# Altium schematic sheet fMuxBoardOverview.SchDoc: Overview of fMux MotherBoard
size C; Author: Matt.Dobbs@McGill.ca; Revision: 3, Oct 2007; PageSetup: Record=PageOptions|CenterHorizontal=True|CenterVertical=True|PrintScale=0.54|XCorrection=1.00|YCorrection=1.00|PrintKind=2|BorderSize=5000000|LeftOffset=0|BottomOffset=0|Orientation=2|PaperLength=1000|PaperWidth=1000|Scale=100|PaperSource=15|PrintQuality=1200|MediaType=1|DitherType=10|PaperKind=Letter|PrintScaleMode=1
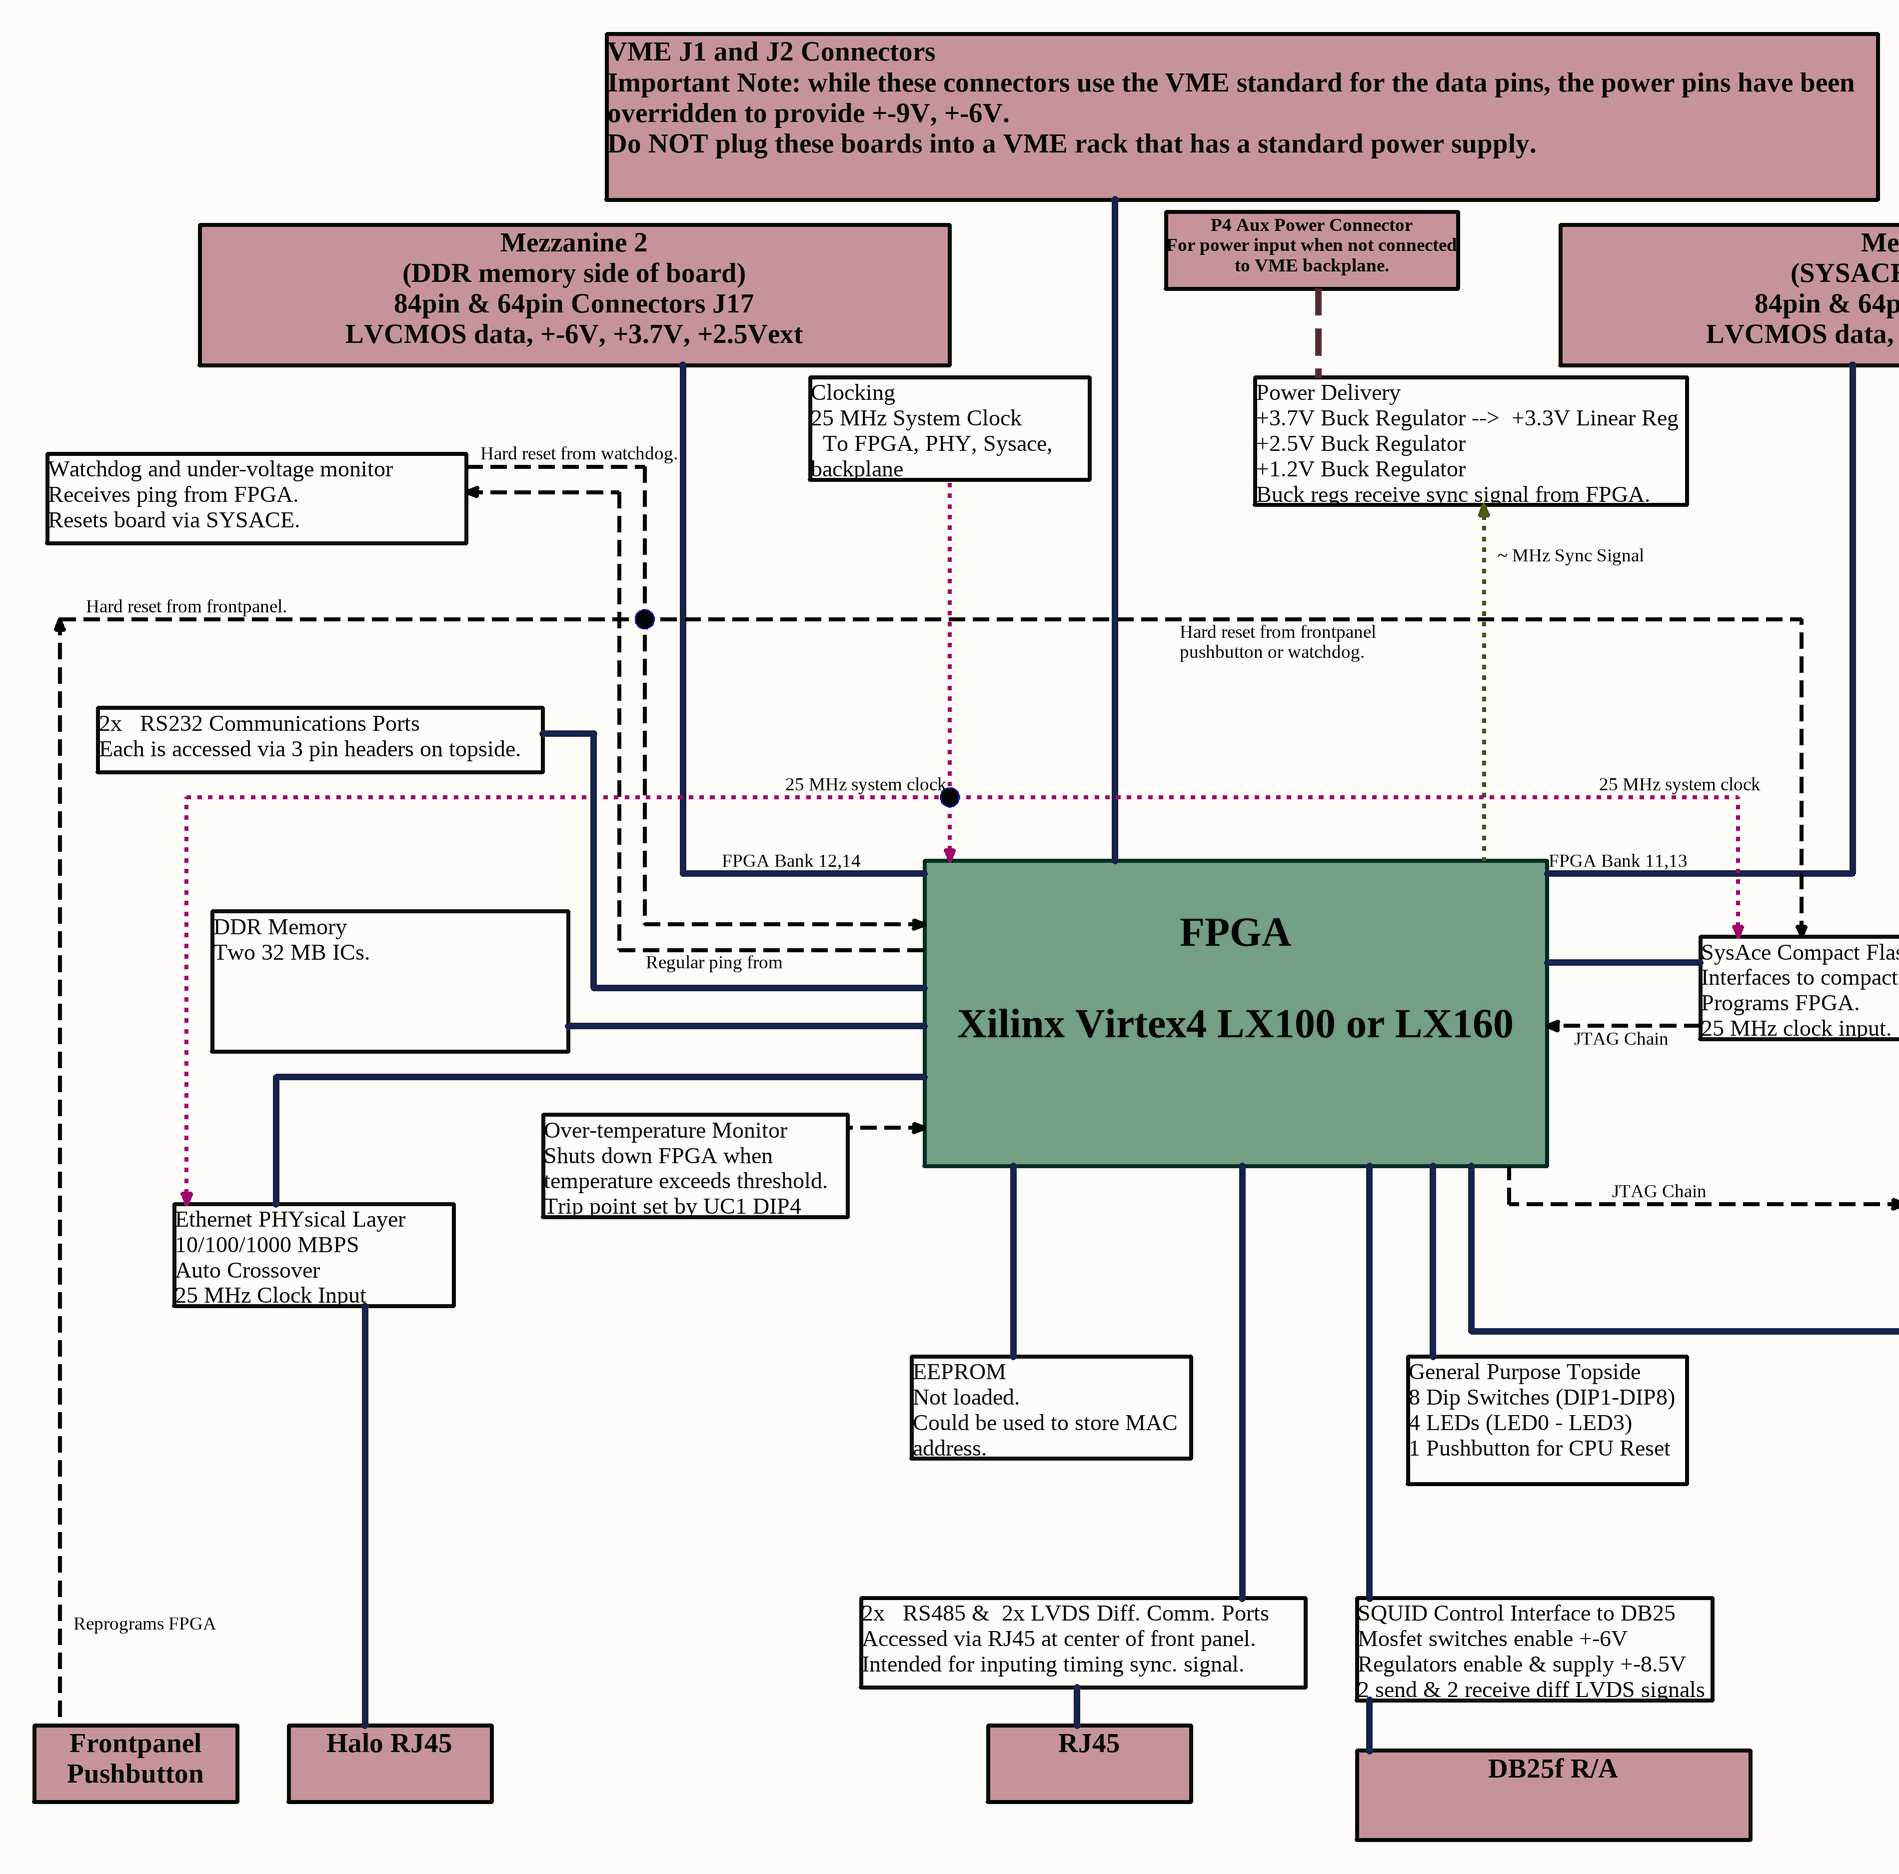
[diagram p0: fMuxBoardOverview.SchDoc, left]
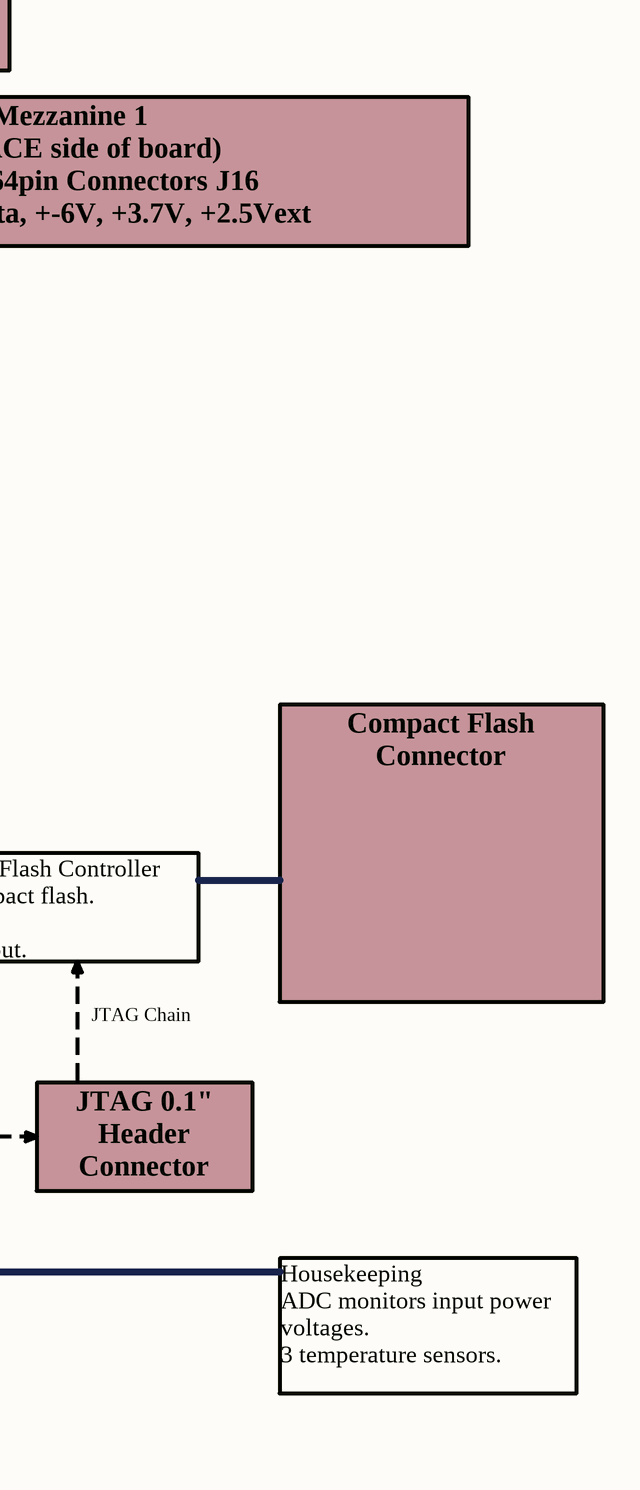
[diagram p1: fMuxBoardOverview.SchDoc, right]

## Notes on the sheet
- VME J1 and J2 Connectors
  Important Note: while these connectors use the VME standard for the data pins, the power pins have been overridden to provide +-9V, +-6V.
  Do NOT plug these boards into a VME rack that has a standard power supply.
- P4 Aux Power Connector
  For power input when not connected to VME backplane.
- Mezzanine 2
  (DDR memory side of board)
  84pin & 64pin Connectors J17
  LVCMOS data, +-6V, +3.7V, +2.5Vext
- Mezzanine 1
  (SYSACE side of board)
  84pin & 64pin Connectors J16
  LVCMOS data, +-6V, +3.7V, +2.5Vext
- Hard reset from watchdog.
- Clocking
  25 MHz System Clock
  To FPGA, PHY, Sysace, backplane
  Sourced from half size (DIP8) socket or backplane.
  To/from backplane as LVCMOS and/or LVDS.
  User Clock to FPGA (not normally used)
- Power Delivery
  +3.7V Buck Regulator -->  +3.3V Linear Reg
  +2.5V Buck Regulator
  +1.2V Buck Regulator
  Buck regs receive sync signal from FPGA.
- Watchdog and under-voltage monitor
  Receives ping from FPGA.
  Resets board via SYSACE.
- ~ MHz Sync Signal
- Hard reset from frontpanel.
- Hard reset from frontpanel pushbutton or watchdog.
- 2x   RS232 Communications Ports
  Each is accessed via 3 pin headers on topside.
- 25 MHz system clock
- FPGA Bank 12,14
- FPGA Bank 11,13
- Regular ping from FPGA (~1 Hz)
- DDR Memory
  Two 32 MB ICs.
- JTAG Chain
- SysAce Compact Flash Controller
  Interfaces to compact flash.
  Programs FPGA.
  25 MHz clock input.
- Compact Flash Connector
- Over-temperature Monitor
  Shuts down FPGA when temperature exceeds threshold. Trip point set by UC1 DIP4 switch.
- FPGA
  Xilinx Virtex4 LX100 or LX160
- JTAG 0.1" Header Connector
- Ethernet PHYsical Layer
  10/100/1000 MBPS
  Auto Crossover
  25 MHz Clock Input
- EEPROM
  Not loaded.
  Could be used to store MAC address.
- Housekeeping
  ADC monitors input power voltages.
  3 temperature sensors.
- General Purpose Topside
  8 Dip Switches (DIP1-DIP8)
  4 LEDs (LED0 - LED3)
  1 Pushbutton for CPU Reset
- Reprograms FPGA with SYSACE
- 2x   RS485 &  2x LVDS Diff. Comm. Ports
  Accessed via RJ45 at center of front panel.
  Intended for inputing timing sync. signal.
- SQUID Control Interface to DB25
  Mosfet switches enable +-6V
  Regulators enable & supply +-8.5V
  2 send & 2 receive diff LVDS signals
- Frontpanel
  Pushbutton
- Halo RJ45
- RJ45
- DB25f R/A